# Altium schematic sheet Metlino_CLK_Distribution.SchDoc: Metlino
size 420 x 297 mm; CheckedBy: P.Kulik,T.Przywozki,W.Ruclo; Author: G.Kasprowicz; CompanyName: WUT ISE; DrawnBy: G.Kasprowicz; Organization: WUT ISE; Address1: PW ISE; Address2: Nowowiejska 15/19 00-665 Warsaw; Address3: gkasprow@gmail.com; DocumentNumber: 13; Revision: 2; SheetNumber: 13; SheetTotal: 29; ModifiedBy: -; CheckedDate: -; Title2: Clock distribution; DivGrp: WUT ISE; Designer: G.Kasprowicz; ModifiedDate: -; ProjectName: Sensor Box
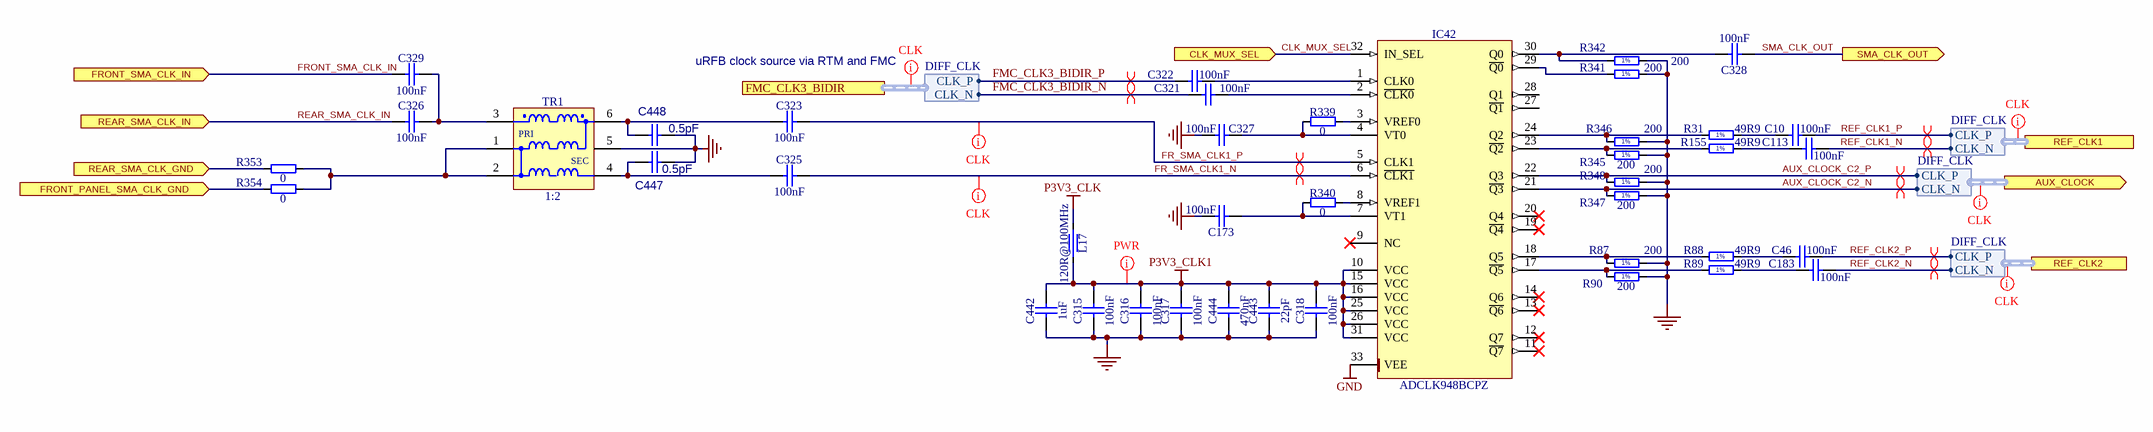
[diagram p0: Metlino_CLK_Distribution.SchDoc]

## Parts
C10  100nF  [CAPC0603X33N]
C46  100nF  [CAPC0603X33N]
C113  100nF  [CAPC0603X33N]
C173  100nF  [CAPC0603X33N]
C183  100nF  [CAPC0603X33N]
C315  100nF  [CAPC0603X33N]
C316  100nF  [CAPC0603X33N]
C317  100nF  [CAPC0603X33N]
C318  100nF  [CAPC0603X33N]
C321  100nF  [CAPC0603X33N]
C322  100nF  [CAPC0603X33N]
C323  100nF  [CAPC0603X33N]
C325  100nF  [CAPC0603X33N]
C326  100nF  [CAPC0603X33N]
C327  100nF  [CAPC0603X33N]
C328  100nF  [CAPC0603X33N]
C329  100nF  [CAPC0603X33N]
C442  1uF  [CAPC1005X55N]
C443  22pF  [CAPC1005X55N]
C444  470nF  [CAPC1005X55N]
C447  0.5pF  [CAPC1005X55N]
C448  0.5pF  [CAPC1005X55N]
IC42  ADCLK948BCPZ  [QFN50P500X500X80-33N-S285]
L17  120R@100MHz  [INDC1608X95N]
R31  49R9  [RESC1005X40N]
R87  200  [RESC1005X40N]
R88  49R9  [RESC1005X40N]
R89  49R9  [RESC1005X40N]
R90  200  [RESC1005X40N]
R155  49R9  [RESC1005X40N]
R339  0  [RESC1005X40N]
R340  0  [RESC1005X40N]
R341  200  [RESC1005X40N]
R342  200  [RESC1005X40N]
R345  200  [RESC1005X40N]
R346  200  [RESC1005X40N]
R347  200  [RESC1005X40N]
R348  200  [RESC1005X40N]
R353  0  [RESC1005X40N]
R354  0  [RESC1005X40N]
TR1  1:2  [XFMR_MINI-CIRCUITS_DB1627]

## Ports
AUX_CLOCK (out, harness DIFF_CLK), CLK_MUX_SEL (in), FMC_CLK3_BIDIR (harness DIFF_CLK), FRONT_PANEL_SMA_CLK_GND (in), FRONT_SMA_CLK_IN (in), REAR_SMA_CLK_GND (in), REAR_SMA_CLK_IN (in), REF_CLK1 (harness DIFF_CLK), REF_CLK2 (harness DIFF_CLK), SMA_CLK_OUT (out)

## Harnesses
DIFF_CLK: CLK_N, CLK_P

## Nets
GND: C173.2 C315.1 C316.1 C317.1 C318.1 C327.2 C442.2 C443.1 C444.1 C447.2 C448.2 IC42.33(VEE) R87.2 R90.2 R341.2 R342.2 R345.2 R346.2 R347.2 R348.2 TR1.5(NC)
P3V3_CLK: L17.1
P3V3_CLK1: C315.2 C316.2 C317.2 C318.2 C442.1 C443.2 C444.2 IC42.10(VCC) IC42.15(VCC) IC42.16(VCC) IC42.25(VCC) IC42.26(VCC) IC42.31(VCC) L17.2
AUX_CLOCK_C2_N: IC42.21(~{Q3}) R347.1 ; port AUX_CLOCK.CLK_N
AUX_CLOCK_C2_P: IC42.22(Q3) R348.1 ; port AUX_CLOCK.CLK_P
CLK_MUX_SEL: IC42.32(IN_SEL) ; port CLK_MUX_SEL
FMC_CLK3_BIDIR_N: C321.2 ; port FMC_CLK3_BIDIR.CLK_N
FMC_CLK3_BIDIR_P: C322.2 ; port FMC_CLK3_BIDIR.CLK_P
FR_SMA_CLK1_N: C325.2 IC42.6(~{CLK1})
FR_SMA_CLK1_P: C323.2 IC42.5(CLK1)
FRONT_PANEL_SMA_CLK_GND: R354.1 ; port FRONT_PANEL_SMA_CLK_GND
FRONT_SMA_CLK_IN: C329.1 ; port FRONT_SMA_CLK_IN
REAR_SMA_CLK_GND: R353.1 ; port REAR_SMA_CLK_GND
REAR_SMA_CLK_IN: C326.1 ; port REAR_SMA_CLK_IN
REF_CLK1_N: C113.1 ; port REF_CLK1.CLK_N
REF_CLK1_P: C10.1 ; port REF_CLK1.CLK_P
REF_CLK2_N: C183.1 ; port REF_CLK2.CLK_N
REF_CLK2_P: C46.1 ; port REF_CLK2.CLK_P
SMA_CLK_OUT: C328.1 ; port SMA_CLK_OUT
NetC10_2: C10.2 R31.2
NetC46_2: C46.2 R88.2
NetC113_2: C113.2 R155.2
NetC173_1: C173.1 IC42.7(VT1) R340.1
NetC183_2: C183.2 R89.2
NetC321_1: C321.1 IC42.2(~{CLK0})
NetC322_1: C322.1 IC42.1(CLK0)
NetC323_1: C323.1 C448.1 TR1.6(S1)
NetC325_1: C325.1 C447.1 TR1.4(S1)
NetC326_2: C326.2 C329.2 TR1.3(P1)
NetC327_1: C327.1 IC42.4(VT0) R339.1
NetC328_2: C328.2 IC42.30(Q0) R342.1
NetIC42_3: IC42.3(VREF0) R339.2
NetIC42_8: IC42.8(VREF1) R340.2
NetIC42_17: IC42.17(~{Q5}) R89.1 R90.1
NetIC42_18: IC42.18(Q5) R87.1 R88.1
NetIC42_23: IC42.23(~{Q2}) R155.1 R345.1
NetIC42_24: IC42.24(Q2) R31.1 R346.1
NetIC42_29: IC42.29(~{Q0}) R341.1
NetR353_2: R353.2 R354.2 TR1.1(P1) TR1.2(P1)

Not connected (* = marked no-connect by the designer): IC42 9(NC)* 11(~{Q7})* 12(Q7)* 13(~{Q6})* 14(Q6)* 19(~{Q4})* 20(Q4)* 27(~{Q1}) 28(Q1)

## Layout directives
differential pair: AUX_CLOCK_C2_N, AUX_CLOCK_C2_P, FMC_CLK3_BIDIR_N, FMC_CLK3_BIDIR_P, FR_SMA_CLK1_N, FR_SMA_CLK1_P, REF_CLK1_N, REF_CLK1_P, REF_CLK2_N, REF_CLK2_P
net class CLK: (no net found under the mark), FR_SMA_CLK1_N, FR_SMA_CLK1_P
net class PWR: P3V3_CLK1

## Notes on the sheet
- uRFB clock source via RTM and FMC
- Project/Equipment
- Document
- Designer
- Drawn by
- Check.by
- Copyright WUT ISE 2018.
  This documentation describes Open Hardware and is licensed under the CERN OHL v.1.1. You may redistribute and modify this documentation under the terms of the CERN OHL v.1.1. (http://ohwr.org/CERNOHL). This documentation is distributed WITHOUT ANY EXPRESS OR IMPLIED WARRANTY, INCLUDING OF MERCHANTABILITY, SATISFACTORY QUALITY AND FITNESS FOR A PARTICULAR PURPOSE. Please see the CERN OHL v.1.1 for applicable conditions.
- Contact
- File
- Last Mod.
- Print Date
- Sheet
- Size
- A3
- of
- Rev
- (in symbol R0402_49R9_1%_0.0625W_100PPM) 1%
- (in symbol R0402_200R_1%_0.0625W_100PPM) 1%
- (in symbol XFMR_MINI-CIRCUITS_TCM2-43X+) PRI; SEC

## Library data of the parts
C10 C46 C113 C173 C183 C315-C318 C321-C323 C325-C329 = CC0201_100NF_6.3V_10%_X5R: Non-polarised capacitor; Manufacturer: GENERIC; Part Description: SMD Multilayer Chip Ceramic Capacitor; Manufacturer1 Part Number: 02016D104KAT2A; Tolerance: ±10%; Voltage: 6.3V; TC: X5R; Manufacturer Part Number: CC0201_100NF_6.3V_10%_X5R; Part Number: CC0201_100NF_6.3V_10%_X5R; Value: 100nF; Component Kind: Standard; Component Type: Standard; Pin Count: 2; Status: Not Recommended; Case: 0201; Mounted: Yes; Socket: No; SMD: Yes; Sense: No; Manufacturer1 Example: AVX; Manufacturer1 ComponentHeight: 0.33mm; HelpURL: \\cern.ch\dfs\Applications\Altium\Datasheets\CC0201_X5R_AVX.pdf; Author: CERN DEM JLC; CreateDate: 03.12.2007; LatestRevisionDate: 03.12.2007
C442 = CC0402_1UF_16V_10%_X5R: Non-polarised capacitor; Manufacturer: GENERIC; Part Description: SMD Multilayer Chip Ceramic Capacitor; Manufacturer1 Part Number: C1005X5R1C105KT; Tolerance: ±10%; Voltage: 16V; TC: X5R; Manufacturer Part Number: CC0402_1UF_16V_10%_X5R; Part Number: CC0402_1UF_16V_10%_X5R; Value: 1uF; Component Kind: Standard; Component Type: Standard; Pin Count: 2; Status: Preferred; Case: 0402; Mounted: Yes; Socket: No; SMD: Yes; Sense: No; Manufacturer1 Example: TDK; Manufacturer1 ComponentHeight: 0.55mm; HelpURL: \\cern.ch\dfs\Applications\Altium\Datasheets\CC0402_X5R_TDK_C.pdf; Author: CERN DEM JLC; CreateDate: 25.10.2012; LatestRevisionDate: 25.10.2012
C443 = CC0402_22PF_50V_5%_C0G: Non-polarised capacitor; Manufacturer: GENERIC; Part Description: SMD Multilayer Chip Ceramic Capacitor; Manufacturer1 Part Number: C0402C220J5GACTU; Tolerance: ±5%; Voltage: 50V; TC: C0G/NP0; Manufacturer Part Number: CC0402_22PF_50V_5%_C0G; Part Number: CC0402_22PF_50V_5%_C0G; Value: 22pF; Component Kind: Standard; Component Type: Standard; Pin Count: 2; Status: Preferred; Case: 0402; Mounted: Yes; Socket: No; SMD: Yes; Sense: No; Manufacturer1 Example: KEMET; Manufacturer1 ComponentHeight: 0.55mm; HelpURL: \\cern.ch\dfs\Applications\Altium\Datasheets\CC0805_C0G_KEMET_(Commercial Grade).pdf; Author: CERN DEM JLC; CreateDate: 03.12.2007; LatestRevisionDate: 03.12.2007
C444 = CC0402_470NF_16V_10%_X5R: Non-polarised capacitor; Manufacturer: GENERIC; Part Description: SMD Multilayer Chip Ceramic Capacitor; Manufacturer1 Part Number: C1005X5R1C105KT; Tolerance: ±10%; Voltage: 16V; TC: X5R; Manufacturer Part Number: CC0402_470NF_16V_10%_X5R; Part Number: CC0402_470NF_16V_10%_X5R; Value: 470nF; Component Kind: Standard; Component Type: Standard; Pin Count: 2; Status: Preferred; Case: 0402; Mounted: Yes; Socket: No; SMD: Yes; Sense: No; Manufacturer1 Example: TDK; Manufacturer1 ComponentHeight: 0.55mm; HelpURL: \\cern.ch\dfs\Applications\Altium\Datasheets\CC0402_X5R_TDK_C.pdf; Author: CERN DEM JLC; CreateDate: 25.10.2012; LatestRevisionDate: 25.10.2012
C447 = CAPC1005X55N: $$NotCommonProperty_General Part Number: CC0402_0.5PF_25V_0.25PF_C0G; $$NotCommonProperty_Manufacturer1 Example: AVX; $$NotCommonProperty_Manufacturer1 Part Number: 04023J0R5ABSTR; Manufacturer Part Number: CC0402_0.5PF_25V_0.05PF_C0G; Manufacturer: GENERIC; Part Description: SMD Multilayer Chip Ceramic Capacitor; Part Name: Capacitor - non polarized CAPC1005X55N; $$Internal_Resolution: 00001mm; $$NotCommonProperty_Case: 0402; $$NotCommonProperty_Pin Count: 2; $$NotCommonProperty_SMD: Yes; $$NotCommonProperty_Status: Preferred; $$NotCommonProperty_TC: C0G/NP0; $$NotCommonProperty_Voltage: 25V; CmpIndex: 53; DXDB_LIBNAME: Capacitors SMD; Ref Designator: C447; SymIndex: 331; Tolerance: ±0.05pF; Cell Name: CAPC1005X55N; Part Number: Capacitor - non polarized CAPC1005X55N; Value: 0.5pF; Orientation: 0 = 0
C448 = CAPC1005X55N: $$NotCommonProperty_General Part Number: CC0402_0.5PF_25V_0.25PF_C0G; $$NotCommonProperty_Manufacturer1 Example: AVX; $$NotCommonProperty_Manufacturer1 Part Number: 04023J0R5ABSTR; Manufacturer Part Number: CC0402_0.5PF_25V_0.05PF_C0G; Manufacturer: GENERIC; Part Description: SMD Multilayer Chip Ceramic Capacitor; Part Name: Capacitor - non polarized CAPC1005X55N; $$Internal_Resolution: 00001mm; $$NotCommonProperty_Case: 0402; $$NotCommonProperty_Pin Count: 2; $$NotCommonProperty_SMD: Yes; $$NotCommonProperty_Status: Preferred; $$NotCommonProperty_TC: C0G/NP0; $$NotCommonProperty_Voltage: 25V; CmpIndex: 57; DXDB_LIBNAME: Capacitors SMD; Ref Designator: C448; SymIndex: 331; Tolerance: ±0.05pF; Cell Name: CAPC1005X55N; Part Number: Capacitor - non polarized CAPC1005X55N; Value: 0.5pF; Orientation: 0 = 0
IC42 = ADCLK948BCPZ: Two Selectable Inputs, 8 LVPECL Outputs, SiGe Clock Fanout Buffer; Manufacturer: ANALOG DEVICES; PressFit: No; Bonding: No; Manufacturer Part Number: ADCLK948BCPZ; PackageDescription: QFN, 0.50mm Pitch, Square; 8 Pin X 8 Pin, 5mm X 5mm X 1.00mm H body (w/thermal tab 2.85 X 2.85mm),  IPC Medium Density; Part Description: Two Selectable Inputs, 8 LVPECL Outputs, SiGe Clock Fanout Buffer; Part Number: ADCLK948BCPZ; Component Kind: Standard; Component Type: Standard; Device: ADCLK948BCPZ; Pin Count: 33; Case: QFN32; Mounted: Yes; Socket: No; SMD: Yes; Sense: No; ComponentHeight: 0.8mm; Author: CERN DEM MR; HelpURL: \\cern.ch\dfs\Applications\Altium\Datasheets\ADCLK948BCPZ.pdf; CreateDate: 30.11.2016; LatestRevisionDate: 30.11.2016
L17 = IND0603_MURATA_BLM18PG121SN1D: Manufacturer: MURATA; Part Description: SMD EMIFIL Chip Ferrite Bead; Power: 2A; Resistance: 0.05R; Manufacturer Part Number: BLM18PG121SN1D; Part Number: IND0603_MURATA_BLM18PG121SN1D; Value: 120R@100MHz; Component Kind: Standard; Component Type: Standard; Pin Count: 2; Status: None; Case: 0603; Mounted: Yes; Socket: No; SMD: Yes; Sense: No; ComponentHeight: 0.95mm; HelpURL: \\cern.ch\dfs\Applications\Altium\Datasheets\IND0603_MURATA_BLM18P.pdf; Author: CERN DEM BC; CreateDate: 27.07.2015; LatestRevisionDate: 25.10.2018
R31 R88 R89 R155 = R0402_49R9_1%_0.0625W_100PPM: Resistor - 1%; Manufacturer: GENERIC; Part Description: General Purpose Thick Film Chip Resistor; Manufacturer1 Part Number: 232270674999L or RC0402FR-0749R9L; TC: ±100ppm/°C; PressFit: No; Manufacturer Part Number: R0402_49R9_1%_0.0625W_100PPM; Part Number: R0402_49R9_1%_0.0625W_100PPM; Tolerance: ±1%; Value: 49R9; Component Kind: Standard; Component Type: Standard; Pin Count: 2; Status: Not Recommended; Power: 0.0625W; Case: 0402; Mounted: Yes; Sense: No; Socket: No; SMD: Yes; Manufacturer1 Example: YAGEO PHYCOMP; Manufacturer1 ComponentHeight: 0.4mm; HelpURL: \\cern.ch\dfs\Applications\Altium\Datasheets\R0402_Phycomp_RC0402.pdf; Author: CERN DEM JLC; CreateDate: 24.10.2012; LatestRevisionDate: 24.10.2012
R87 R90 R341 R342 R345-R348 = R0402_200R_1%_0.0625W_100PPM: Resistor - 1%; Manufacturer: GENERIC; Part Description: General Purpose Thick Film Chip Resistor; Manufacturer1 Part Number: 232270672001L; TC: ±100ppm/°C; PressFit: No; Manufacturer Part Number: R0402_200R_1%_0.0625W_100PPM; Part Number: R0402_200R_1%_0.0625W_100PPM; Tolerance: ±1%; Value: 200; Component Kind: Standard; Component Type: Standard; Pin Count: 2; Status: Not Recommended; Power: 0.0625W; Case: 0402; Mounted: Yes; Sense: No; Socket: No; SMD: Yes; Manufacturer1 Example: YAGEO PHYCOMP; Manufacturer1 ComponentHeight: 0.4mm; HelpURL: \\cern.ch\dfs\Applications\Altium\Datasheets\R0402_Phycomp_RC0402.pdf; Author: CERN DEM JLC; CreateDate: 03.12.2007; LatestRevisionDate: 17.10.2012
R339 R340 R353 R354 = R0402_0R_JUMPER: Resistor; Manufacturer: GENERIC; Part Description: 1A (0.05R Max DC Resistance) Zero Ohm Jumper; Manufacturer1 Part Number: 232270591001L; PressFit: No; Manufacturer Part Number: R0402_0R_JUMPER; Part Number: R0402_0R_JUMPER; Value: 0; Component Kind: Standard; Component Type: Standard; Pin Count: 2; Status: Not Recommended; Case: 0402; Mounted: Yes; Sense: No; Socket: No; SMD: Yes; Manufacturer1 Example: YAGEO PHYCOMP; Manufacturer1 ComponentHeight: 0.4mm; HelpURL: \\cern.ch\dfs\Applications\Altium\Datasheets\R0402_Phycomp_RC0402.pdf; Author: CERN DEM JLC; CreateDate: 03.12.2007; LatestRevisionDate: 17.10.2012
TR1 = XFMR_MINI-CIRCUITS_TCM2-43X+: 50 OHMS 10 to 4000 MHz RF Transformer; Power: 0.4W; Part Number: XFMR_MINI-CIRCUITS_TCM2-43X+; Component Kind: Standard; Component Type: Standard; Pin Count: 6; Value: 1:2; Status: None; Part Description: 50 Ohms 10 to 4000MHz RF Transformer; Manufacturer: MINI-CIRCUITS; Manufacturer Part Number: TCM2-43X+; Mounted: Yes; Socket: No; Sense: No; SMD: Yes; ComponentHeight: 4.06mm; HelpURL: \\cern.ch\dfs\Applications\Altium\Datasheets\XFMR_MINI-CIRCUITS_TCM2-43X+.pdf; Author: CERN DEM BC; CreateDate: 12.02.2016; LatestRevisionDate: 12.02.2016